# Altium project LimeNet-Micro_2v0.PrjPcb (part 1 of 9)
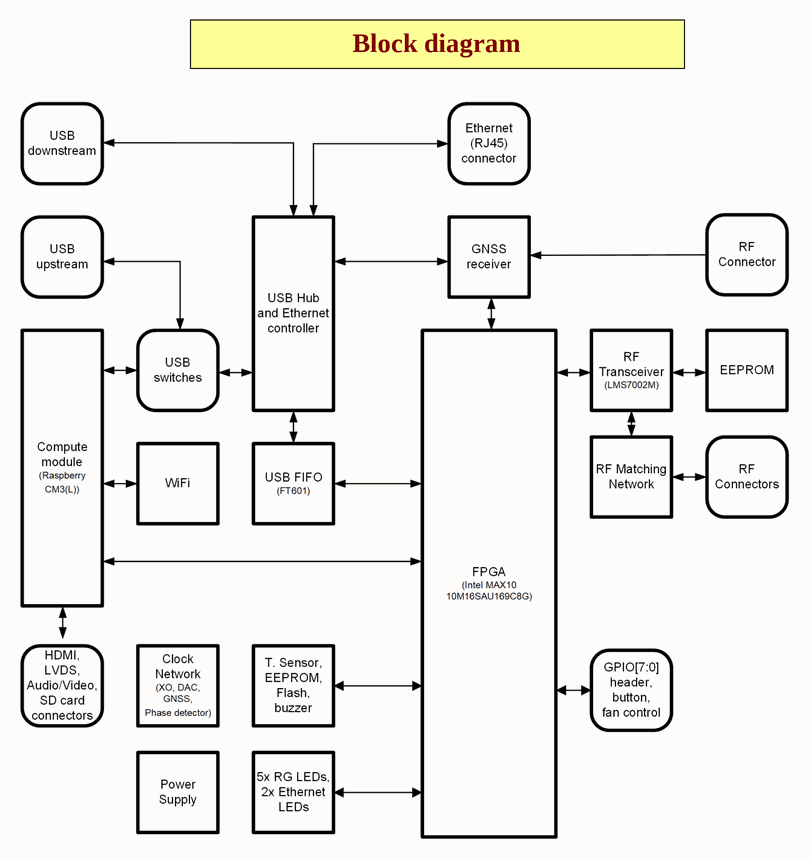
[diagram p0: 01_BlockDiagram.SchDoc]
15 sheets, 786 parts. Net scope: global (net labels, ports and power ports of the same name join across sheets).
Board file: LimeNet-Micro_2v0.PcbDoc
Sheets:
  01_BlockDiagram.SchDoc
  02_PowerDiagram.SchDoc
  03_ClockDiagram.SchDoc
  04_RFDiagram.SchDoc
  05_LMS7002M_Misc.SchDoc
  06_LMS7002M_RF.SchDoc
  07_LMS7002M_Power.SchDoc
  08_FPGA.SchDoc
  09_Misc.SchDoc
  10_USB_Ethernet.SchDoc
  11_USB_FIFO.SchDoc
  12_Raspbbery CM3.SchDoc
  13_Raspberry_Misc.SchDoc
  14_Clocks.SchDoc
  15_PowerSupply.SchDoc

## Sheet 01_BlockDiagram.SchDoc: Block diagram
size A4; Organization: Lime Microsystems; Address1: Surrey Tech Centre; Address2: Guildford GU2 7YG; Address3: Surrey; Address4: United Kingdom; Revision: v2.0; SheetNumber: 1; SheetTotal: 15

### Notes on the sheet
- Block diagram
- Project name:
- Title:
- Size:
- Date:
- A4
- Revision:
- Time:
- Sheet
- of
- File:

## Sheet 02_PowerDiagram.SchDoc: Power diagram
size A4; Organization: Lime Microsystems; Address1: Surrey Tech Centre; Address2: Guildford GU2 7YG; Address3: Surrey; Address4: United Kingdom; Revision: v2.0; SheetNumber: 2; SheetTotal: 15
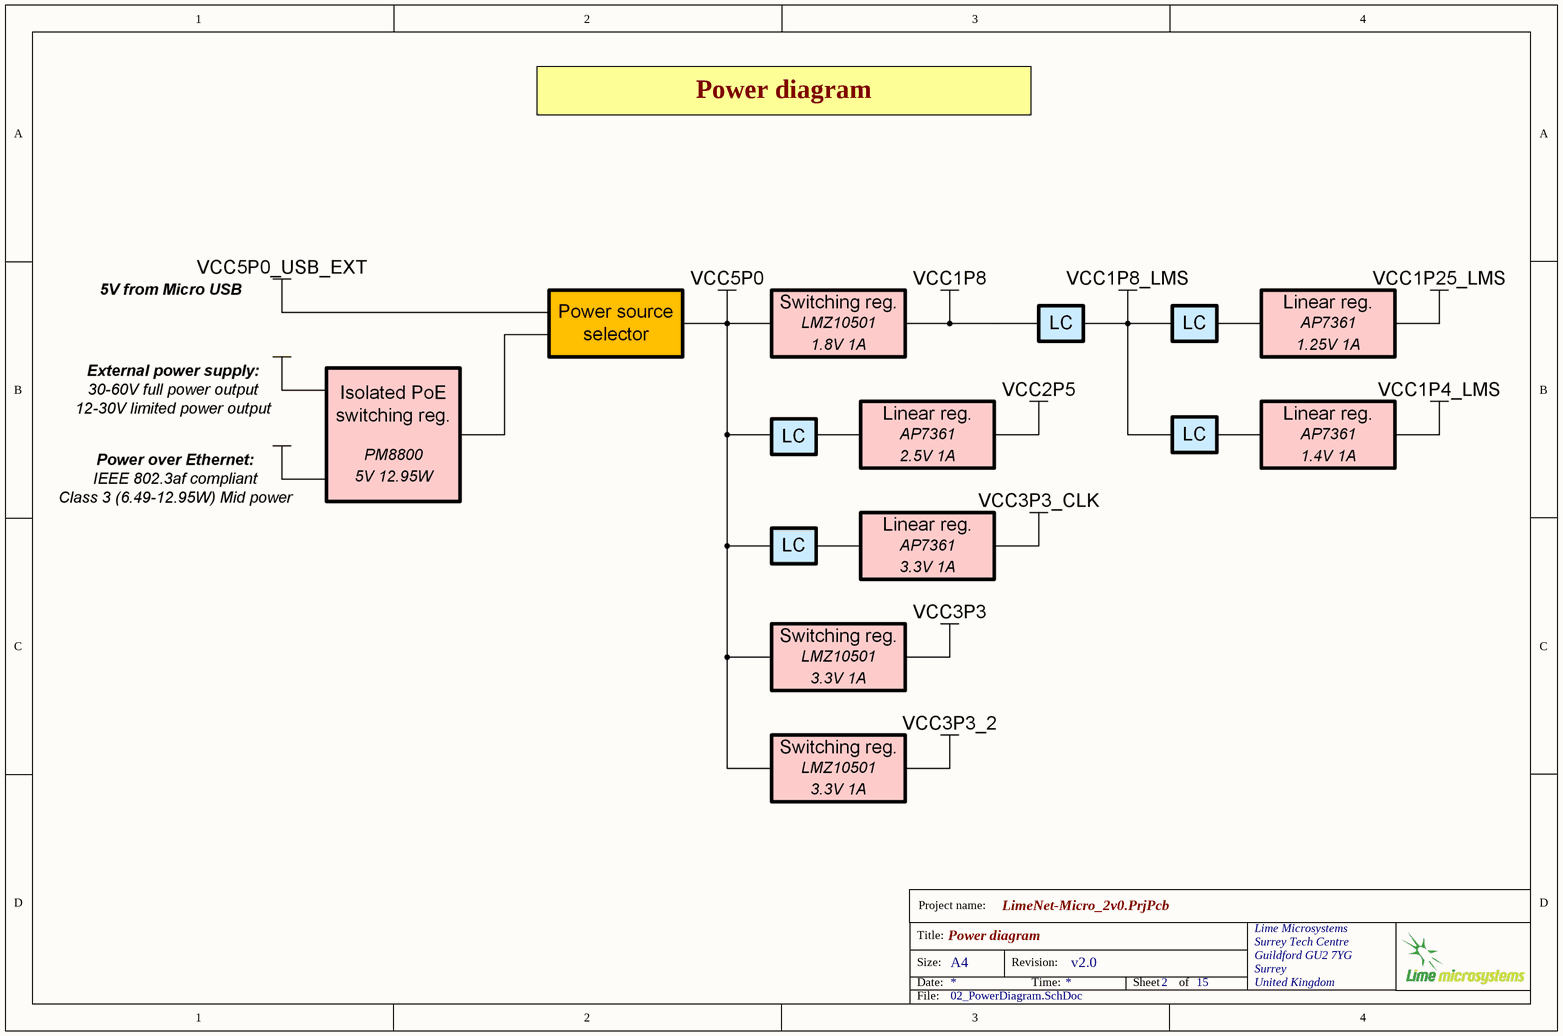
[diagram p1: 02_PowerDiagram.SchDoc]

### Notes on the sheet
- Power diagram
- Project name:
- Title:
- Size:
- Date:
- A4
- Revision:
- Time:
- Sheet
- of
- File:

## Sheet 03_ClockDiagram.SchDoc: Clock diagram
size A4; Organization: Lime Microsystems; Address1: Surrey Tech Centre; Address2: Guildford GU2 7YG; Address3: Surrey; Address4: United Kingdom; Revision: v2.0; SheetNumber: 3; SheetTotal: 15
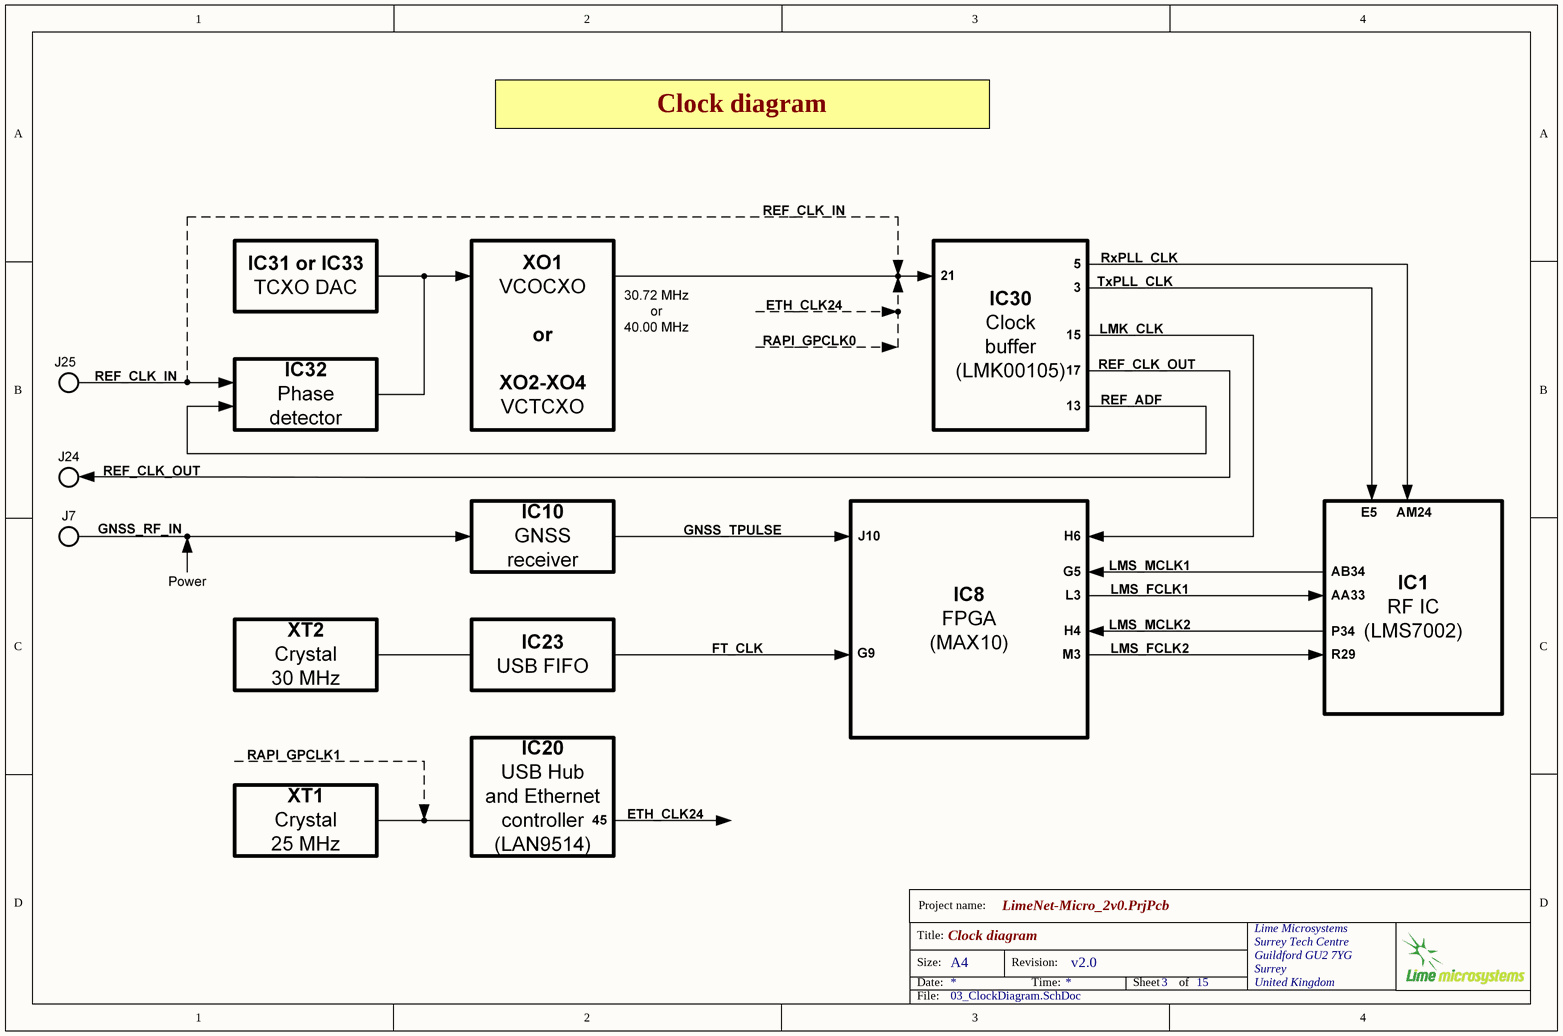
[diagram p2: 03_ClockDiagram.SchDoc]

### Notes on the sheet
- Clock diagram
- Project name:
- Title:
- Size:
- Date:
- A4
- Revision:
- Time:
- Sheet
- of
- File:

## Sheet 04_RFDiagram.SchDoc: RF diagram
size A4; Organization: Lime Microsystems; Address1: Surrey Tech Centre; Address2: Guildford GU2 7YG; Address3: Surrey; Address4: United Kingdom; Revision: v2.0; SheetNumber: 4; SheetTotal: 15
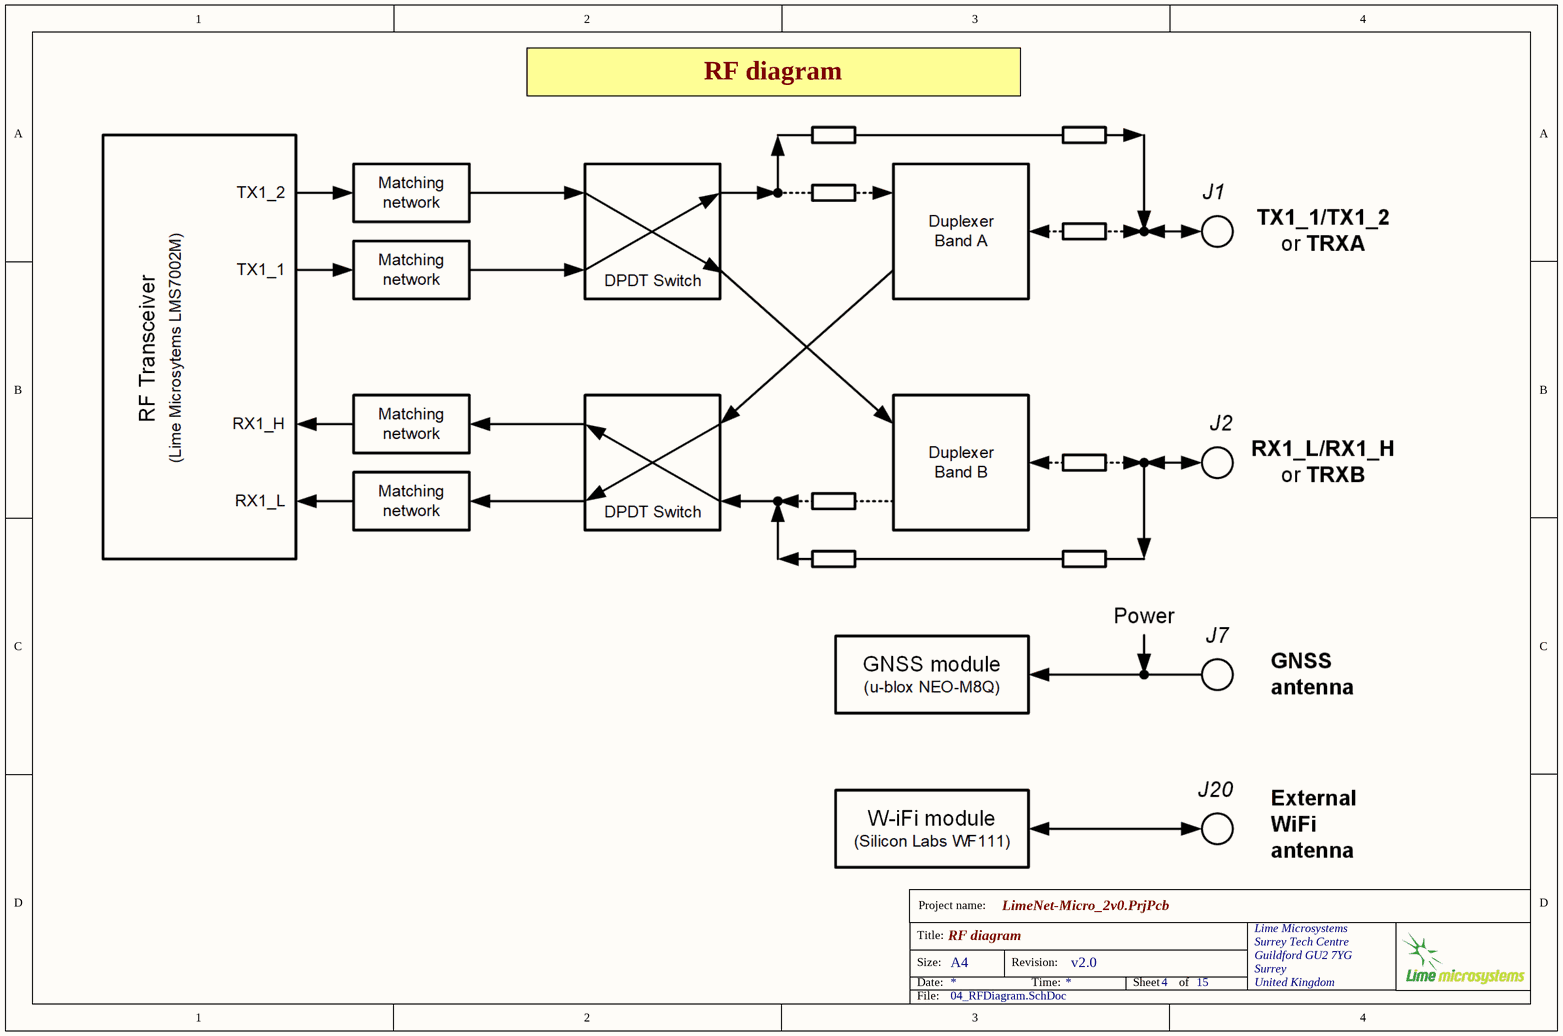
[diagram p3: 04_RFDiagram.SchDoc]

### Notes on the sheet
- RF diagram
- Project name:
- Title:
- Size:
- Date:
- A4
- Revision:
- Time:
- Sheet
- of
- File:

## Sheet 05_LMS7002M_Misc.SchDoc: LMS7002M misc
size A3; Organization: Lime Microsystems; Address1: Surrey Tech Centre; Address2: Guildford GU2 7YG; Address3: Surrey; Address4: United Kingdom; Revision: v2.0; SheetNumber: 5; SheetTotal: 15
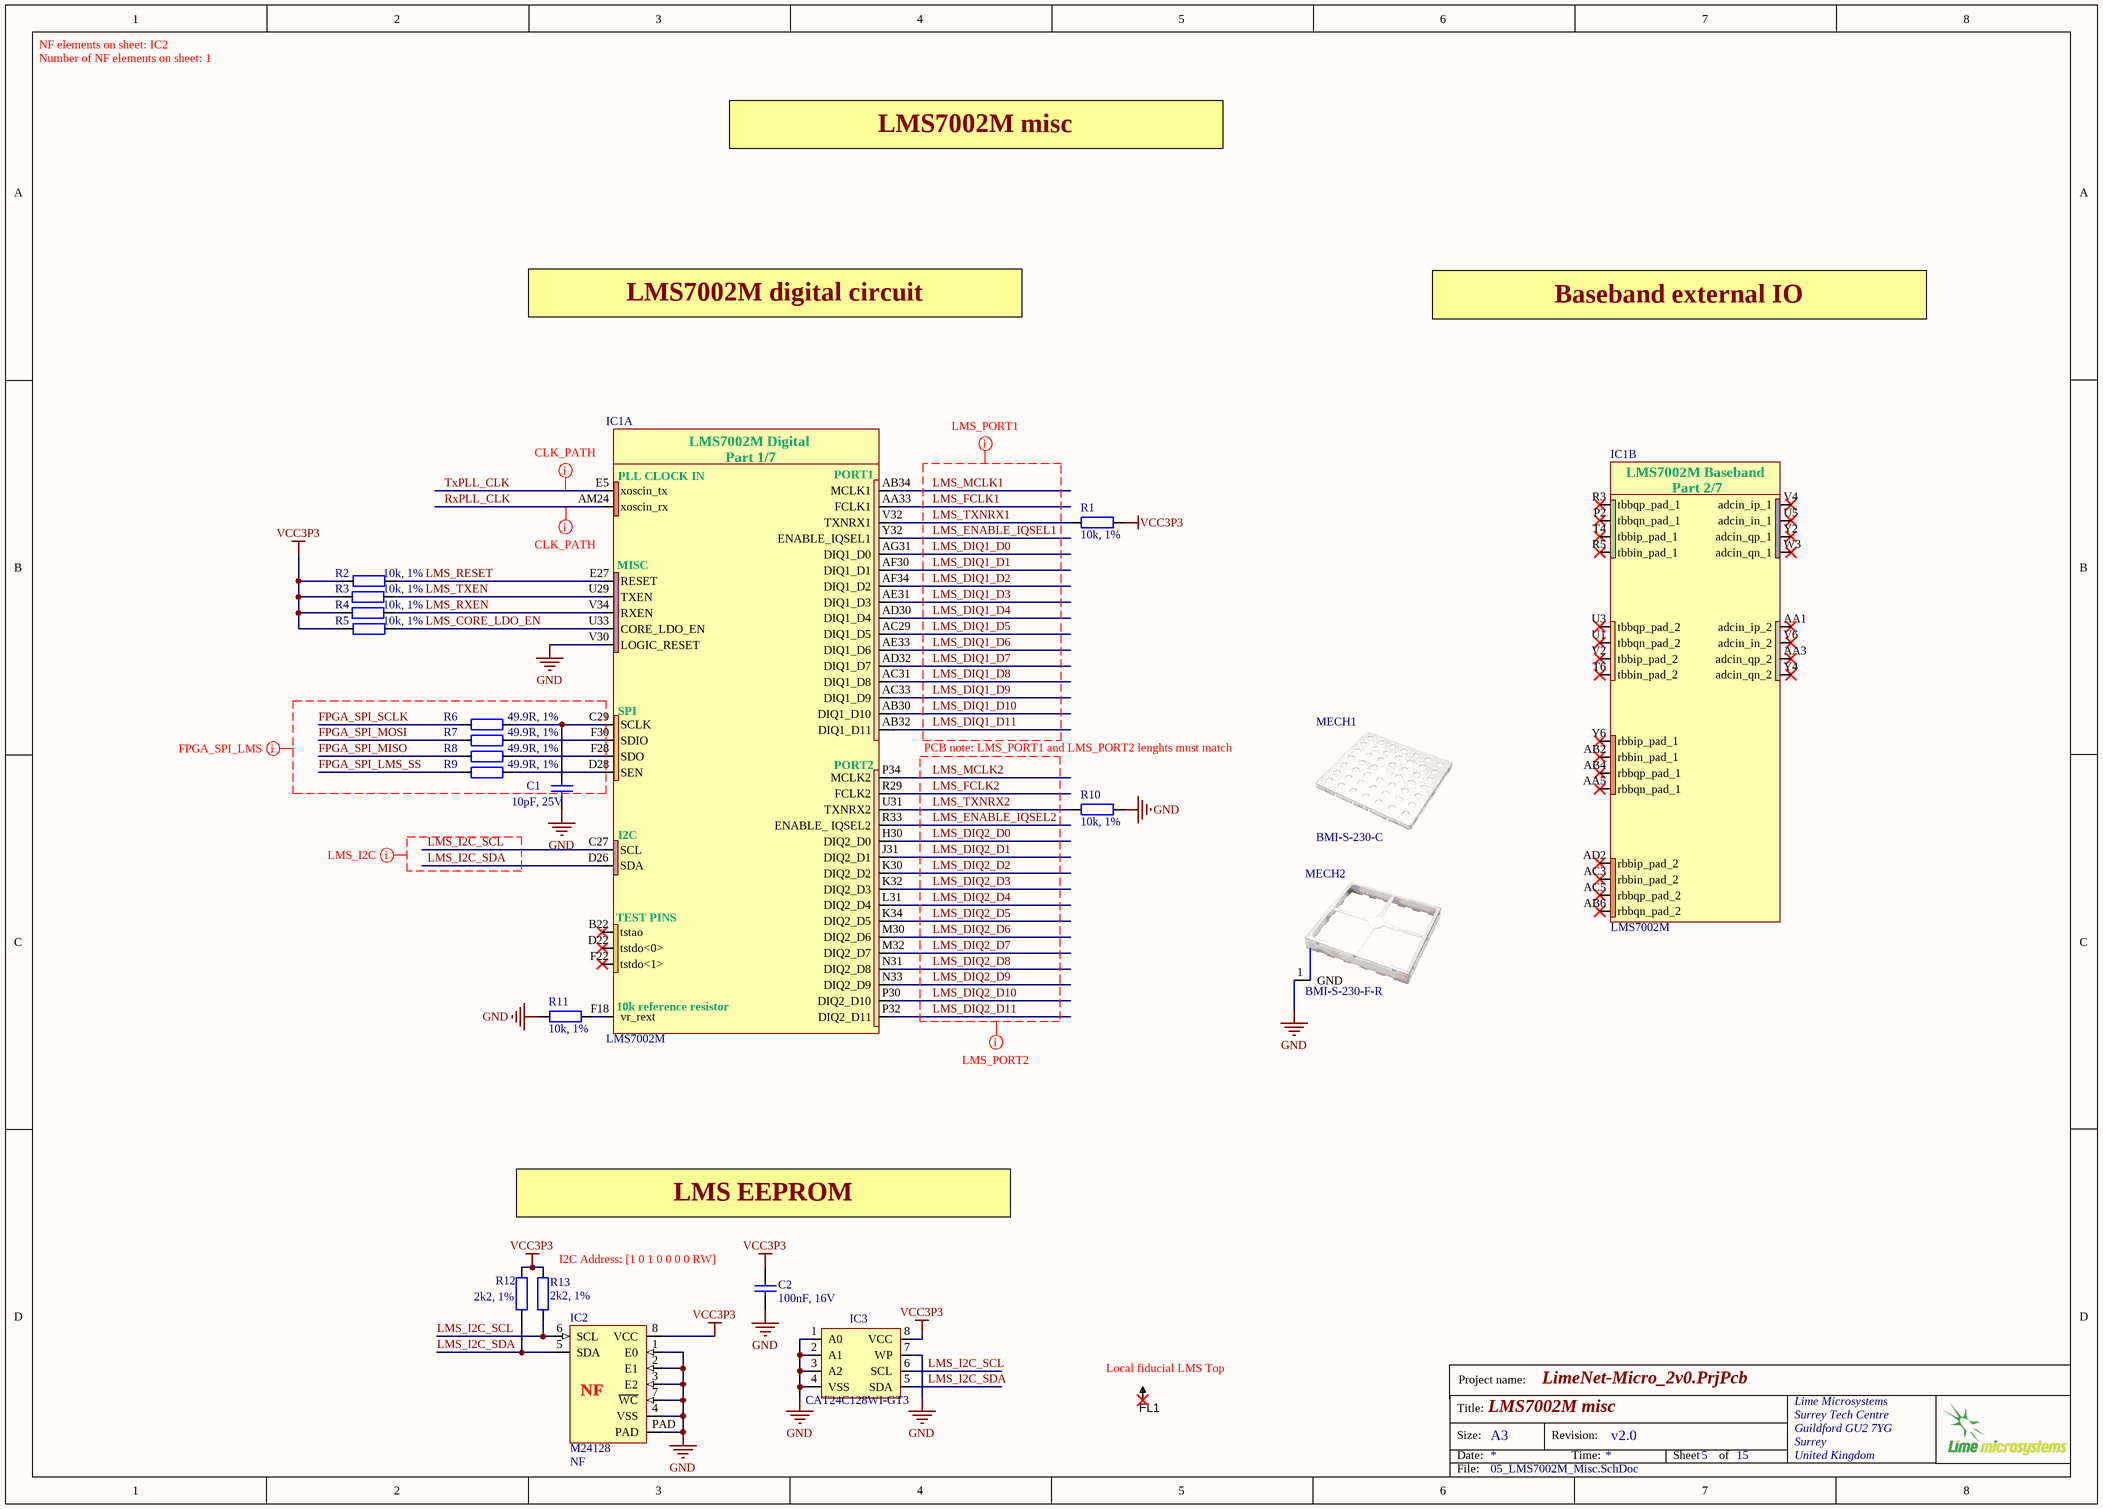
[diagram p4: 05_LMS7002M_Misc.SchDoc]

### Parts
C1  10pF, 25V  [CAP0402]
C2  100nF, 16V  [CAP0402]
FL1  Fiducial  [Fiducial_local]  (value not drawn)
IC1  LMS7002M  [LMS7002M_v5]  (parts A,B of 7)
IC2  M24128  Assembly Info: NF  [M24128-DFMC6TG]
IC3  CAT24C128WI-GT3  [SOIC127P600-8DL_v2]
MECH1  BMI-S-230-C  (mechanical)
MECH2  BMI-S-230-F-R  [RFI_SHIELD_BMI-S-230-F-R]
R1  10k, 1%  [RES0402]
R2  10k, 1%  [RES0402]
R3  10k, 1%  [RES0402]
R4  10k, 1%  [RES0402]
R5  10k, 1%  [RES0402]
R6  49.9R, 1%  [RES0402]
R7  49.9R, 1%  [RES0402]
R8  49.9R, 1%  [RES0402]
R9  49.9R, 1%  [RES0402]
R10  10k, 1%  [RES0402]
R11  10k, 1%  [RES0402]
R12  2k2, 1%  [RES0402]
R13  2k2, 1%  [RES0402]

### Nets
GND: C1.2 C2.2 IC1.V30(LOGIC_RESET) IC2.1(E0) IC2.2(E1) IC2.3(E2) IC2.4(VSS) IC2.7(~{WC}) IC2.PAD IC3.1(A0) IC3.2(A1) IC3.3(A2) IC3.4(VSS) IC3.7(WP) MECH2.1(GND) R10.2 R11.2
VCC3P3: C2.1 IC2.8(VCC) IC3.8(VCC) R1.2 R2.2 R3.1 R4.1 R5.2 R12.1 R13.1
FPGA_SPI_LMS_SS: R9.2
FPGA_SPI_MISO: R8.2
FPGA_SPI_MOSI: R7.2
FPGA_SPI_SCLK: R6.2
LMS_CORE_LDO_EN: IC1.U33(CORE_LDO_EN) R5.1
LMS_DIQ1_D0: IC1.AG31(DIQ1_D0)
LMS_DIQ1_D1: IC1.AF30(DIQ1_D1)
LMS_DIQ1_D2: IC1.AF34(DIQ1_D2)
LMS_DIQ1_D3: IC1.AE31(DIQ1_D3)
LMS_DIQ1_D4: IC1.AD30(DIQ1_D4)
LMS_DIQ1_D5: IC1.AC29(DIQ1_D5)
LMS_DIQ1_D6: IC1.AE33(DIQ1_D6)
LMS_DIQ1_D7: IC1.AD32(DIQ1_D7)
LMS_DIQ1_D8: IC1.AC31(DIQ1_D8)
LMS_DIQ1_D9: IC1.AC33(DIQ1_D9)
LMS_DIQ1_D10: IC1.AB30(DIQ1_D10)
LMS_DIQ1_D11: IC1.AB32(DIQ1_D11)
LMS_DIQ2_D0: IC1.H30(DIQ2_D0)
LMS_DIQ2_D1: IC1.J31(DIQ2_D1)
LMS_DIQ2_D2: IC1.K30(DIQ2_D2)
LMS_DIQ2_D3: IC1.K32(DIQ2_D3)
LMS_DIQ2_D4: IC1.L31(DIQ2_D4)
LMS_DIQ2_D5: IC1.K34(DIQ2_D5)
LMS_DIQ2_D6: IC1.M30(DIQ2_D6)
LMS_DIQ2_D7: IC1.M32(DIQ2_D7)
LMS_DIQ2_D8: IC1.N31(DIQ2_D8)
LMS_DIQ2_D9: IC1.N33(DIQ2_D9)
LMS_DIQ2_D10: IC1.P30(DIQ2_D10)
LMS_DIQ2_D11: IC1.P32(DIQ2_D11)
LMS_ENABLE_IQSEL1: IC1.Y32(ENABLE_IQSEL1)
LMS_ENABLE_IQSEL2: IC1.R33(ENABLE__IQSEL2)
LMS_FCLK1: IC1.AA33(FCLK1)
LMS_FCLK2: IC1.R29(FCLK2)
LMS_I2C_SCL: IC1.C27(SCL) IC2.6(SCL) IC3.6(SCL) R13.2
LMS_I2C_SDA: IC1.D26(SDA) IC2.5(SDA) IC3.5(SDA) R12.2
LMS_MCLK1: IC1.AB34(MCLK1)
LMS_MCLK2: IC1.P34(MCLK2)
LMS_RESET: IC1.E27(RESET) R2.1
LMS_RXEN: IC1.V34(RXEN) R4.2
LMS_TXEN: IC1.U29(TXEN) R3.2
LMS_TXNRX1: IC1.V32(TXNRX1) R1.1
LMS_TXNRX2: IC1.U31(TXNRX2) R10.1
RxPLL_CLK: IC1.AM24(xoscin_rx)
TxPLL_CLK: IC1.E5(xoscin_tx)
NetC1_1: C1.1 IC1.C29(SCLK) R6.1
NetIC1_D28: IC1.D28(SEN) R9.1
NetIC1_F18: IC1.F18(vr_rext) R11.1
NetIC1_F28: IC1.F28(SDO) R8.1
NetIC1_F30: IC1.F30(SDIO) R7.1

Not connected (* = marked no-connect by the designer): FL1 1*; IC1 AA1(adcin_ip_2)* AA3(adcin_qp_2)* AA5(rbbqn_pad_1)* AB2(rbbin_pad_1)* AB4(rbbqp_pad_1)* AB6(rbbqn_pad_2)* AC3(rbbin_pad_2)* AC5(rbbqp_pad_2)* AD2(rbbip_pad_2)* B22(tstao)* D22(tstdo<0>)* F22(tstdo<1>)* P2(tbbqn_pad_1)* R3(tbbqp_pad_1)* R5(tbbin_pad_1)* T4(tbbip_pad_1)* T6(tbbin_pad_2)* U1(tbbqn_pad_2)* U3(tbbqp_pad_2)* U5(adcin_in_1)* V2(tbbip_pad_2)* V4(adcin_ip_1)* V6(adcin_in_2)* W3(adcin_qn_1)* Y2(adcin_qp_1)* Y4(adcin_qn_2)* Y6(rbbip_pad_1)*

### Layout directives
net class CLK_PATH: RxPLL_CLK, TxPLL_CLK
net class FPGA_SPI_LMS: FPGA_SPI_LMS_SS, FPGA_SPI_MISO, FPGA_SPI_MOSI, FPGA_SPI_SCLK
net class LMS_I2C: LMS_I2C_SCL, LMS_I2C_SDA
net class LMS_PORT1: LMS_DIQ1_D0, LMS_DIQ1_D1, LMS_DIQ1_D2, LMS_DIQ1_D3, LMS_DIQ1_D4, LMS_DIQ1_D5, LMS_DIQ1_D6, LMS_DIQ1_D7, LMS_DIQ1_D8, LMS_DIQ1_D9, LMS_DIQ1_D10, LMS_DIQ1_D11, LMS_ENABLE_IQSEL1, LMS_FCLK1, LMS_MCLK1, LMS_TXNRX1
net class LMS_PORT2: LMS_DIQ2_D0, LMS_DIQ2_D1, LMS_DIQ2_D2, LMS_DIQ2_D3, LMS_DIQ2_D4, LMS_DIQ2_D5, LMS_DIQ2_D6, LMS_DIQ2_D7, LMS_DIQ2_D8, LMS_DIQ2_D9, LMS_DIQ2_D10, LMS_DIQ2_D11, LMS_ENABLE_IQSEL2, LMS_FCLK2, LMS_MCLK2, LMS_TXNRX2

### Notes on the sheet
- NF elements on sheet: IC2
- Number of NF elements on sheet: 1
- LMS7002M misc
- LMS7002M digital circuit
- Baseband external IO
- PCB note: LMS_PORT1 and LMS_PORT2 lenghts must match
- LMS EEPROM
- I2C Address: [1 0 1 0 0 0 0 RW]
- (near IC2) NF
- (near FL1) Local fiducial LMS Top
- Project name:
- Title:
- Size:
- Date:
- A3
- Revision:
- Time:
- Sheet
- of
- File:
- (in symbol LMS7002Mr3, part A) LMS7002M Digital; Part 1/7; PLL CLOCK IN; PORT1; MISC; SPI; PORT2; I2C; TEST PINS; 10k reference resistor
- (in symbol LMS7002Mr3, part B) LMS7002M Baseband; Part 2/7

### Library data of the parts
C1 = Cap_0402: Manufacturer Part Number 1: 04023A100JAT2A; Manufacturer: AVX; Part Description: 10pF ±5% 25V C0G, NP0 Ceramic Capacitor -55°C ~ 125°C Surface Mount, MLCC 0402 (1005 Metric) 0.039" L x 0.020" W (1.00mm x 0.50mm); Capacitance Tolerance: ± 5%; Voltage Rating: 25; Ceramic Capacitor Case: 0402 [1005 Metric]; Capacitor Case Style: 0402 [1005 Metric]<!--FANDB--><div class="features-and-benefits-container"></div>; Dielectric Characteristic: C0G / NP0; SVHC: No SVHC (16-Jun-2014); Capacitance: 10; Value: 10pF, 25V; Supplier 1: Farnell; Supplier Part Number 1: 2332478RL; Product Range: -; RoHS: YES; Operating Temperature Min: -55; Operating Temperature Max: 125; Capacitance Tolerance ±: ± 5%; MSL: MSL 1 - Unlimited; Packaging: Cut Tape
C2 = Cap_0603: Manufacturer Part Number 1: GRM155R71C104KA88D; Part Description: CAP CER 0.1UF 16V X7R 0402; Brand: Murata Electronics; Tolerance: 10 %; Type: General Purpose MLCC; Capacitance: 0.1 uF; Temperature Coefficient / Code: +/- 15 %; Supplier 1: Mouser; Supplier Part Number 1: 81-GRM155R71C104KA88; Case Code - in: 0402; Manufacturer: Murata Electronics; Category: Multilayer Ceramic Capacitors MLCC - SMD/SMT; Voltage Rating DC: 16 V; Value: 100nF, 16V; Maximum Operating Temperature: + 125 C; Minimum Operating Temperature: - 55 C; Minimum Order Quantity: 1; Operating Temperature Range: - 55 C to + 125 C; Package / Case: 0402 (1005 metric); Packaging: Reel; Product: General Type MLCCs; Product Category: Low & Medium Capacitance SMD Ceramic Chip Capacitors; Reeling: True; RoHS - Mouser: Y; RoHS: RoHS Compliant; Series: GRM; Standard Pack Qty: 10000; Termination Style: SMD/SMT
IC1 = LMS7002Mr3: Schematic symbol revision 3. Default footprint - 0.31mm pad; Manufacturer: Lime Microsystems; Part Description: IC FPRF Transceiver LMS7002M; 261 pin aQFN; Supplier 1: Lime Microsystems; Supplier Part Number 1: LMS7002M; Manufacturer Part Number 1: LMS7002M
IC2 = M24128-DFMC6TG: Manufacturer: STMicroelectronics; Part Description: EEPROM Memory IC 128Kb (16K x 8) I²C 1MHz 450ns 8-UFDFPN (2x3); Memory Type: Non-Volatile; Memory Format: EEPROM; Memory Size: 128Kb (16K x 8); Write Cycle Time - Word, Page: 5ms; Memory Interface: I²C; Voltage - Supply: 1.7 V ~ 5.5 V; Supplier 1: Digi-Key; Manufacturer Part Number 1: M24128-DFMC6TG; RoHS: RoHS Compliant; Category: Integrated Circuits (ICs); Stock 1: 5894; Pricing 1: 1=0.35, 10=0.348, 100=0.2854, 500=0.27748, 1000=0.27004 (USD); Packaging: Cut Tape (CT); Part Status: Active; Technology: EEPROM; Operating Temperature: -40°C ~ 85°C (TA); Mounting Type: Surface Mount; Package / Case: 8-UFDFN Exposed Pad; Supplier Device Package: 8-UFDFPN (2x3); ComponentLink1URL: http://www.st.com/content/ccc/resource/technical/document/datasheet/59/05/c9/5b/7b/41/48/b6/CD00259167.pdf/files/CD00259167.pdf/jcr:content/translations/en.CD00259167.pdf; ComponentLink1Description: http://www.st.com/content/ccc/resource/technical/document/datasheet/59/05/c9/5b/7b/41/48/b6/CD00259167.pdf/files/CD00259167.pdf/jcr:content/translations/en.CD00259167.pdf; Supplier Part Number 1: 497-15739-1-ND
IC3 = 24FC64F: Part Description: EEPROM Memory IC 128Kb (16K x 8) I²C 1MHz 400ns 8-SOIC; Manufacturer: ON Semiconductor; Memory Type: Non-Volatile; Memory Format: EEPROM; Memory Size: 128Kb (16K x 8); Write Cycle Time - Word, Page: 5ms; Memory Interface: I²C; Voltage - Supply: 1.8 V ~ 5.5 V; Supplier 1: Digi-Key; Supplier Part Number 1: CAT24C128WI-GT3CT-ND; Manufacturer Part Number 1: CAT24C128WI-GT3; RoHS: RoHS Compliant; Category: Integrated Circuits (ICs); Stock 1: 14804; Pricing 1: 1=0.31, 10=0.309, 100=0.2532, 500=0.24616, 1000=0.23956 (USD); Packaging: Cut Tape (CT); Part Status: Active; Technology: EEPROM; Operating Temperature: -40°C ~ 85°C (TA); Mounting Type: Surface Mount; Package / Case: 8-SOIC (0.154", 3.90mm Width); Supplier Device Package: 8-SOIC; Base Part Number: CAT24C128; ComponentLink1URL: http://www.onsemi.com/pub/Collateral/CAT24C128-D.PDF; ComponentLink1Description: http://www.onsemi.com/pub/Collateral/CAT24C128-D.PDF
MECH1 = RFI_SHIELD_2_cover: Part Description: RF Shield Cover 2.000" (50.80mm) X 1.500" (38.10mm) Vent Holes in Pattern Snap Fit; Manufacturer: Laird Technologies EMI; Ventilation: Vent Holes in Pattern; Supplier 1: Digi-Key; Supplier Part Number 1: 903-1471-ND; Manufacturer Part Number 1: BMI-S-230-C; RoHS: RoHS Compliant; Category: RF/IF and RFID; Stock 1: 15865; Pricing 1: 1=1.51, 10=1.333, 25=1.2044, 100=1.0537, 250=0.92472, 500=0.8172, 1000=0.64515, 2500=0.60214, 5000=0.57203 (USD); Packaging: Bulk; Part Status: Active; Type: Cover; Height - Overall: 0.200" (5.08mm); Length - Overall: 1.500" (38.10mm); Width - Overall: 2.000" (50.80mm); Mounting Type: Snap Fit; ComponentLink1URL: https://media.digikey.com/pdf/Data%20Sheets/Laird%20Technologies/BMI-S-230-C_Dwg.pdf; ComponentLink1Description: https://media.digikey.com/pdf/Data%20Sheets/Laird%20Technologies/BMI-S-230-C_Dwg.pdf
MECH2 = RFI_SHIELD_2_frame: Part Description: RF Shield Frame 2.000" (50.80mm) X 1.500" (38.10mm) Solder; Manufacturer: Laird Technologies EMI; Supplier 1: Digi-Key; Supplier Part Number 1: 903-1470-1-ND; Manufacturer Part Number 1: BMI-S-230-F-R; RoHS: RoHS Compliant; Category: RF/IF and RFID; Stock 1: 12638; Pricing 1: 1=1.95, 10=1.726, 25=1.5588 (USD); Packaging: Cut Tape (CT); Part Status: Active; Type: Frame; Height - Overall: 0.200" (5.08mm); Length - Overall: 1.500" (38.10mm); Width - Overall: 2.000" (50.80mm); Ventilation: -; Mounting Type: Solder; ComponentLink1URL: https://media.digikey.com/pdf/Data%20Sheets/Laird%20Technologies/BMI-S-230-F_Dwg.pdf; ComponentLink1Description: https://media.digikey.com/pdf/Data%20Sheets/Laird%20Technologies/BMI-S-230-F_Dwg.pdf
R1-R5 R10 R11 = Res_0402: Manufacturer: Yageo; Manufacturer Part Number 1: RC0402FR-0710KL; Part Description: RES SMD 10K OHM 1% 1/16W 0402; Temperature Coefficient: ±100ppm/°C; Power (Watts): 0.063W, 1/16W; Value: 10k, 1%; Supplier 1: Digi-Key; Supplier Part Number 1: 311-10.0KLRTR-ND; Resistance (Ohms): 10k; Packaging: Tape & Reel (TR); RoHS: RoHS Compliant; Package / Case: 0402 (1005 Metric); Tolerance: ±1%; Operating Temperature: -55°C ~ 155°C; Size / Dimension: 0.039" L x 0.020" W (1.00mm x 0.50mm); Number of Terminations: 2; Category: Resistors; Height: 0.016" (0.40mm); Supplier Device Package: 0402; Features: Moisture Resistant; Composition: Thick Film
R6-R9 = Res_0402: Manufacturer: Samsung Electro-Mechanics America, Inc.; Manufacturer Part Number: RC1005F49R9CS; Part Description: RES SMD 49.9 OHM 1% 1/16W 0402; Temperature Coefficient: ±100ppm/°C; Resistance (Ohms): 49.9; Power (Watts): 0.063W, 1/16W; Number of Terminations: 2; Size / Dimension: 0.039" L x 0.020" W (1.00mm x 0.50mm); Supplier Device Package: 0402 (1005 Metric); RoHS: RoHS Compliant; Supplier Part Number 1: 1276-3469-6-ND; Features: -; Packaging: Digi-Reel®; Tolerance: ±1%; Height: 0.016" (0.40mm); Category: Resistors; Composition: Thick Film; Package / Case: 0402 (1005 Metric); Supplier 1: Digi-Key; Operating Temperature: -55°C ~ 155°C; Value: 49.9R, 1%
R12 R13 = Res_0402: Manufacturer: Stackpole Electronics Inc; Manufacturer Part Number 1: RMCF0402FT2K20; Part Description: RES SMD 2.2K OHM 1% 1/16W 0402; Resistance (Ohms): 2.2k; Temperature Coefficient: ±100ppm/°C; Power (Watts): 0.063W, 1/16W; Value: 2k2, 1%; Supplier 1: Digi-Key; Supplier Part Number 1: RMCF0402FT2K20CT-ND; Supplier Device Package: 0402; Package / Case: 0402 (1005 Metric); Size / Dimension: 0.039" L x 0.020" W (1.00mm x 0.50mm); Operating Temperature: -55°C ~ 155°C; Composition: Thick Film; Category: Resistors; Features: -; Height: 0.016" (0.40mm); RoHS: RoHS Compliant; Number of Terminations: 2; Packaging: Cut Tape (CT); Tolerance: ±1%

## Sheet 06_LMS7002M_RF.SchDoc: LMS7002M RF
size A3; Organization: Lime Microsystems; Address1: Surrey Tech Centre; Address2: Guildford GU2 7YG; Address3: Surrey; Address4: United Kingdom; Revision: v2.0; SheetNumber: 6; SheetTotal: 15
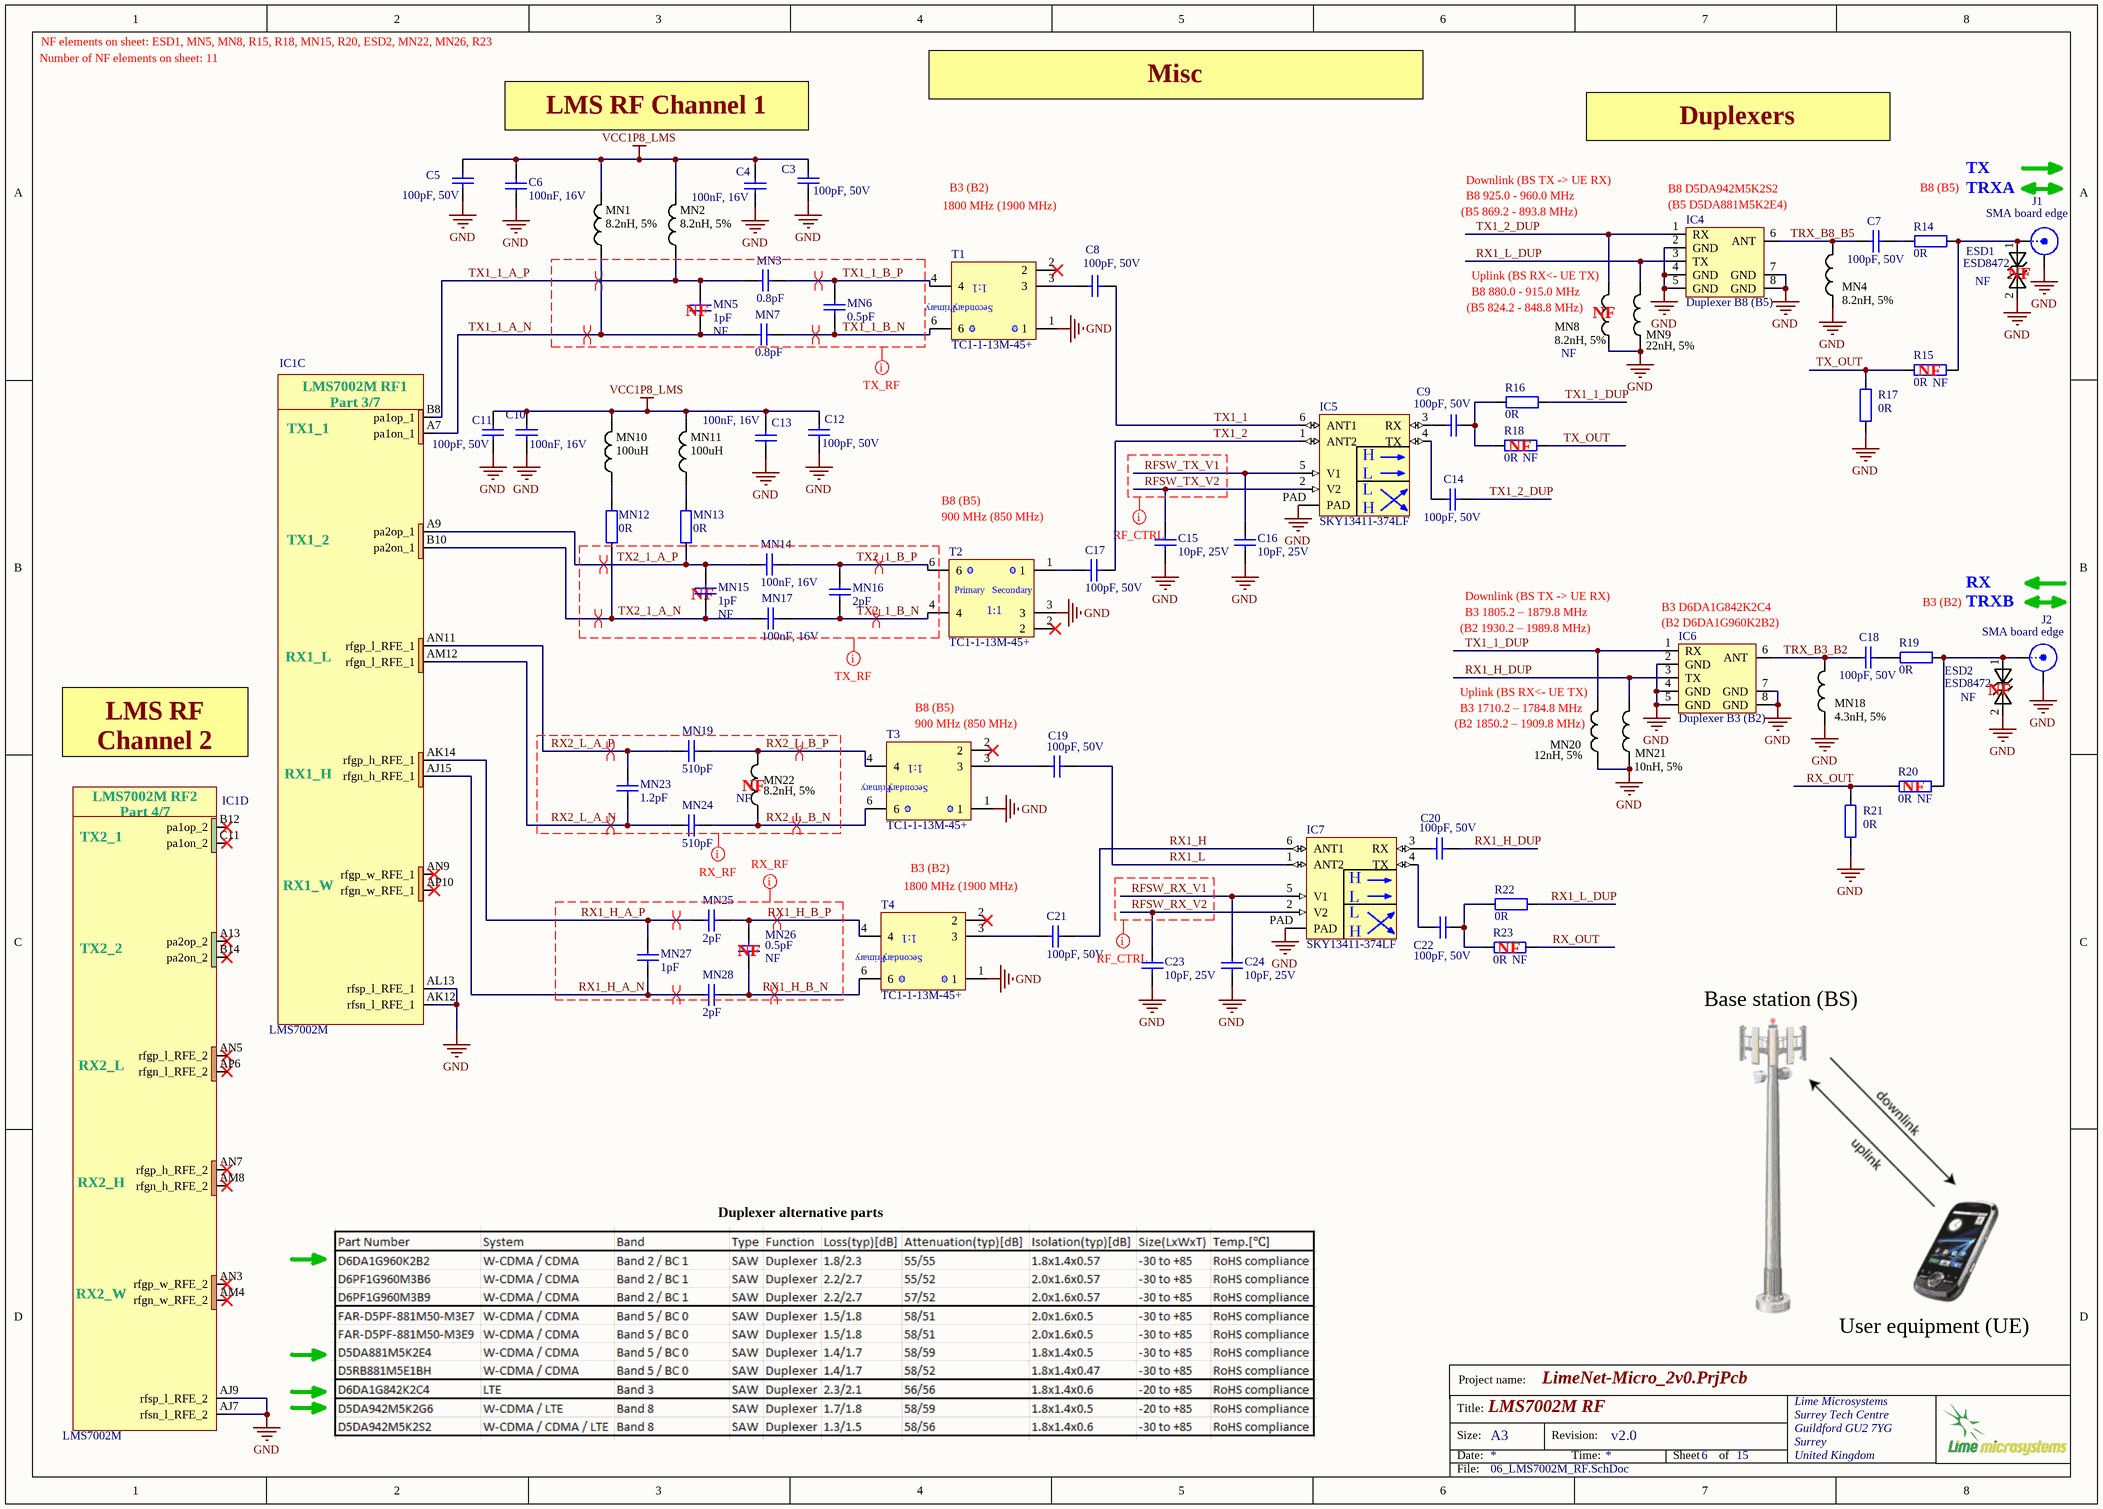
[diagram p5: 06_LMS7002M_RF.SchDoc]

### Parts
C3  100pF, 50V  [CAP0402]
C4  100nF, 16V  [CAP0402]
C5  100pF, 50V  [CAP0402]
C6  100nF, 16V  [CAP0402]
C7  100pF, 50V  [CAP0402]
C8  100pF, 50V  [CAP0402]
C9  100pF, 50V  [CAP0402]
C10  100nF, 16V  [CAP0402]
C11  100pF, 50V  [CAP0402]
C12  100pF, 50V  [CAP0402]
C13  100nF, 16V  [CAP0402]
C14  100pF, 50V  [CAP0402]
C15  10pF, 25V  [CAP0402]
C16  10pF, 25V  [CAP0402]
C17  100pF, 50V  [CAP0402]
C18  100pF, 50V  [CAP0402]
C19  100pF, 50V  [CAP0402]
C20  100pF, 50V  [CAP0402]
C21  100pF, 50V  [CAP0402]
C22  100pF, 50V  [CAP0402]
C23  10pF, 25V  [CAP0402]
C24  10pF, 25V  [CAP0402]
ESD1  ESD8472  Assembly Info: NF  [ESD8472_X3DFN2]
ESD2  ESD8472  Assembly Info: NF  [ESD8472_X3DFN2]
IC1  LMS7002M  [LMS7002M_v5]  (parts C,D of 7)
IC4  Duplexer B8 (B5)  [SAW_filter_duplexer_TAIYO_YUDEN_1p8x1p4_2p0x1p6]
IC5  SKY13411-374LF  [SKY13411-374LF]
IC6  Duplexer B3 (B2)  [SAW_filter_duplexer_TAIYO_YUDEN_1p8x1p4_2p0x1p6]
IC7  SKY13411-374LF  [SKY13411-374LF]
J1  SMA board edge  [SMA_connector_board_edge_SM]
J2  SMA board edge  [SMA_connector_board_edge_SM]
MN1  8.2nH, 5%  [RES0402]
MN2  8.2nH, 5%  [RES0402]
MN3  0.8pF  [CAP0402]
MN4  8.2nH, 5%  [RES0402]
MN5  1pF  Assembly Info: NF  [CAP0402]
MN6  0.5pF  [CAP0402]
MN7  0.8pF  [CAP0402]
MN8  8.2nH, 5%  Assembly Info: NF  [RES0402]
MN9  22nH, 5%  [RES0402]
MN10  100uH  [RES0805]
MN11  100uH  [RES0805]
MN12  0R  [RES0402]
MN13  0R  [RES0402]
MN14  100nF, 16V  [CAP0402]
MN15  1pF  Assembly Info: NF  [CAP0402]
MN16  2pF  [CAP0402]
MN17  100nF, 16V  [CAP0402]
MN18  4.3nH, 5%  [RES0402]
MN19  510pF  [CAP0402]
MN20  12nH, 5%  [RES0402]
MN21  10nH, 5%  [RES0402]
MN22  8.2nH, 5%  Assembly Info: NF  [RES0402]
MN23  1.2pF  [CAP0402]
MN24  510pF  [CAP0402]
MN25  2pF  [CAP0402]
MN26  0.5pF  Assembly Info: NF  [CAP0402]
MN27  1pF  [CAP0402]
MN28  2pF  [CAP0402]
R14  0R  [RES0402_v3]
R15  0R  Assembly Info: NF  [RES0402_v3]
R16  0R  [RES0402_v3]
R17  0R  [RES0402]
R18  0R  Assembly Info: NF  [RES0402_v3]
R19  0R  [RES0402_v3]
R20  0R  Assembly Info: NF  [RES0402_v3]
R21  0R  [RES0402]
R22  0R  [RES0402_v3]
R23  0R  Assembly Info: NF  [RES0402_v3]
T1  TC1-1-13M-45+  [TC1-1-13MA+_JA4220-AL_]
T2  TC1-1-13M-45+  [TC1-1-13MA+_JA4220-AL_]
T3  TC1-1-13M-45+  [TC1-1-13MA+_JA4220-AL_]
T4  TC1-1-13M-45+  [TC1-1-13MA+_JA4220-AL_]

### Nets
GND: C3.2 C4.1 C5.2 C6.1 C10.1 C11.2 C12.2 C13.1 C15.1 C16.1 C23.1 C24.1 ESD1.2 ESD2.2 IC1.AJ7(rfsn_l_RFE_2) IC1.AJ9(rfsp_l_RFE_2) IC1.AK12(rfsn_l_RFE_1) IC1.AL13(rfsp_l_RFE_1) IC4.2(GND) IC4.4(GND) IC4.5(GND) IC4.7(GND) IC4.8(GND) IC5.PAD IC6.2(GND) IC6.4(GND) IC6.5(GND) IC6.7(GND) IC6.8(GND) IC7.PAD J1.2(Y) J2.2(Y) MN4.1 MN8.1 MN9.1 MN18.1 MN20.1 MN21.1 R17.2 R21.2 T1.1 T2.3 T3.1 T4.1
VCC1P8_LMS: C3.1 C4.2 C5.1 C6.2 C10.2 C11.1 C12.1 C13.2 MN1.2 MN2.2 MN10.2 MN11.2
RFSW_RX_V1: C24.2 IC7.5(V1)
RFSW_RX_V2: C23.2 IC7.2(V2)
RFSW_TX_V1: C16.2 IC5.5(V1)
RFSW_TX_V2: C15.2 IC5.2(V2)
RX1_H: C21.1 IC7.6(ANT1)
RX1_H_A_N: IC1.AJ15(rfgn_h_RFE_1) MN27.1 MN28.2
RX1_H_A_P: IC1.AK14(rfgp_h_RFE_1) MN25.2 MN27.2
RX1_H_B_N: MN26.1 MN28.1 T4.6
RX1_H_B_P: MN25.1 MN26.2 T4.4
RX1_H_DUP: C20.1 IC6.3(TX) MN21.2
RX1_L: C19.1 IC7.1(ANT2)
RX1_L_DUP: IC4.3(TX) MN9.2 R22.2
RX2_L_A_N: IC1.AM12(rfgn_l_RFE_1) MN23.1 MN24.2
RX2_L_A_P: IC1.AN11(rfgp_l_RFE_1) MN19.2 MN23.2
RX2_L_B_N: MN22.1 MN24.1 T3.6
RX2_L_B_P: MN19.1 MN22.2 T3.4
RX_OUT: R20.1 R21.1 R23.2
TRX_B3_B2: C18.2 IC6.6(ANT) MN18.2
TRX_B8_B5: C7.2 IC4.6(ANT) MN4.2
TX1_1: C8.1 IC5.6(ANT1)
TX1_1_A_N: IC1.A7(pa1on_1) MN1.1 MN5.1 MN7.2
TX1_1_A_P: IC1.B8(pa1op_1) MN2.1 MN3.1 MN5.2
TX1_1_B_N: MN6.2 MN7.1 T1.6
TX1_1_B_P: MN3.2 MN6.1 T1.4
TX1_1_DUP: IC6.1(RX) MN20.2 R16.2
TX1_2: C17.1 IC5.1(ANT2)
TX1_2_DUP: C14.1 IC4.1(RX) MN8.2
TX2_1_A_N: IC1.B10(pa2on_1) MN12.1 MN15.2 MN17.1
TX2_1_A_P: IC1.A9(pa2op_1) MN13.1 MN14.2 MN15.1
TX2_1_B_N: MN16.1 MN17.2 T2.4
TX2_1_B_P: MN14.1 MN16.2 T2.6
TX_OUT: R15.1 R17.1 R18.2
NetC7_1: C7.1 R14.1
NetC8_2: C8.2 T1.3
NetC9_1: C9.1 R16.1 R18.1
NetC9_2: C9.2 IC5.3(RX)
NetC14_2: C14.2 IC5.4(TX)
NetC17_2: C17.2 T2.1
NetC18_1: C18.1 R19.1
NetC19_2: C19.2 T3.3
NetC20_2: C20.2 IC7.3(RX)
NetC21_2: C21.2 T4.3
NetC22_1: C22.1 R22.1 R23.1
NetC22_2: C22.2 IC7.4(TX)
NetESD1_1: ESD1.1 J1.1(X) R14.2 R15.2
NetESD2_1: ESD2.1 J2.1(X) R19.2 R20.2
NetMN10_1: MN10.1 MN12.2
NetMN11_1: MN11.1 MN13.2

Not connected (* = marked no-connect by the designer): IC1 A13(pa2op_2)* AM4(rfgn_w_RFE_2)* AM8(rfgn_h_RFE_2)* AN3(rfgp_w_RFE_2)* AN5(rfgp_l_RFE_2)* AN7(rfgp_h_RFE_2)* AN9(rfgp_w_RFE_1)* AP6(rfgn_l_RFE_2)* AP10(rfgn_w_RFE_1)* B12(pa1op_2)* B14(pa2on_2)* C11(pa1on_2)*; T1 2*; T2 2*; T3 2*; T4 2*

### Layout directives
differential pair: RX1_H_A_N, RX1_H_A_P, RX1_H_B_N, RX1_H_B_P, RX2_L_A_N, RX2_L_A_P, RX2_L_B_N, RX2_L_B_P, TX1_1_A_N, TX1_1_A_P, TX1_1_B_N, TX1_1_B_P, TX2_1_A_N, TX2_1_A_P, TX2_1_B_N, TX2_1_B_P
net class RX_RF: RX1_H_A_N, RX1_H_A_P, RX1_H_B_N, RX1_H_B_P, RX2_L_A_N, RX2_L_A_P, RX2_L_B_N, RX2_L_B_P
net class TX_RF: TX1_1_B_N, TX1_1_B_P, TX2_1_A_N, TX2_1_A_P, TX2_1_B_N, TX2_1_B_P
net class RF_CTRL: RFSW_RX_V1, RFSW_RX_V2, RFSW_TX_V1, RFSW_TX_V2

### Notes on the sheet
- NF elements on sheet: ESD1, MN5, MN8, R15, R18, MN15, R20, ESD2, MN22, MN26, R23
- Number of NF elements on sheet: 11
- Misc
- LMS RF Channel 1
- Duplexers
- TX
- 1800 MHz (1900 MHz)
- B3 (B2)
- (B5 869.2 - 893.8 MHz)
- Downlink (BS TX -> UE RX)
- B8 925.0 - 960.0 MHz
- (near IC4) B8 D5DA942M5K2S2
- (near IC4) (B5 D5DA881M5K2E4)
- B8 (B5)
- TRXA
- (near MN5) NF
- (near MN8) (B5 824.2 - 848.8 MHz)
- (near MN8) B8 880.0 - 915.0 MHz
- (near MN8) Uplink (BS RX<- UE TX)
- (near MN8) NF
- (near ESD1) NF
- (near R15) NF
- (near R18) NF
- 900 MHz (850 MHz)
- (near IC5) H
- (near IC5) L
- RX
- (near MN15) NF
- (B2 1930.2 – 1989.8 MHz)
- B3 1805.2 – 1879.8 MHz
- (near IC6) B3 D6DA1G842K2C4
- (near IC6) (B2 D6DA1G960K2B2)
- TRXB
- (near T3) B8 (B5)
- (near MN20) B3 1710.2 – 1784.8 MHz
- (near MN20) Uplink (BS RX<- UE TX)
- (near ESD2) NF
- LMS RF Channel 2
- (near T3) 900 MHz (850 MHz)
- (near MN20) (B2 1850.2 – 1909.8 MHz)
- (near MN22) NF
- (near R20) NF
- (near T4) 1800 MHz (1900 MHz)
- (near IC7) H
- (near IC7) L
- (near MN26) NF
- (near R23) NF
- Base station (BS)
- Duplexer alternative parts
- User equipment (UE)
- Project name:
- Title:
- Size:
- Date:
- A3
- Revision:
- Time:
- Sheet
- of
- File:
- (in symbol LMS7002Mr3, part C) LMS7002M RF1; Part 3/7; TX1_1; TX1_2; RX1_L; RX1_H; RX1_W
- (in symbol TC1-1-13M+) Primary; Secondary; 1:1

### Library data of the parts
C3 C5 C7-C9 C11 C12 C14 C17-C22 = Cap_0402: Manufacturer Part Number 1: CC0402JRNPO9BN101; Manufacturer: Yageo; Part Description: 100pF ±5% 50V C0G, NP0 Ceramic Capacitor -55°C ~ 125°C Surface Mount, MLCC 0402 (1005 Metric) 0.039" L x 0.020" W (1.00mm x 0.50mm); Tolerance: ±5%; Temperature Coefficient: C0G, NP0; Value: 100pF, 50V; Capacitance: 100pF; Thickness (Max): 0.022" (0.55mm); Size / Dimension: 0.039" L x 0.020" W (1.00mm x 0.50mm); RoHS: RoHS Compliant; Ratings: -; Package / Case: 0402 (1005 Metric); Mounting Type: Surface Mount, MLCC; Height - Seated (Max): -; Features: -; Lead Spacing: -; Voltage - Rated: 50V; Operating Temperature: -55°C ~ 125°C; Packaging: Cut Tape (CT); Applications: General Purpose; Lead Style: -; Supplier 1: Digi-Key; Category: Capacitors; Supplier Part Number 1: 311-1024-1-ND
C4 C6 C10 C13 = Cap_0402: Manufacturer: Murata Electronics; Manufacturer Part Number: GRM155R71C104KA88D; Part Description: CAP CER 0.1UF 16V X7R 0402; Tolerance: 10 %; Type: General Purpose MLCC; Capacitance: 0.1 uF; Case Length: 1 mm; Dielectric: X7R; Case Height: 0.5 mm; Temperature Coefficient / Code: +/- 15 %; Value: 100nF, 16V; Supplier 1: Mouser; Supplier Part Number 1: 81-GRM155R71C104KA88; Case Code - in: 0402; RoHS: RoHS Compliant; Operating Temperature Range: - 55 C to + 125 C; Series: GRM; Termination Style: SMD/SMT; Package / Case: 0402 (1005 metric); Voltage Rating DC: 16 V; Maximum Operating Temperature: + 125 C; Case Code - mm: 1005; Minimum Operating Temperature: - 55 C; Product Category: Low & Medium Capacitance SMD Ceramic Chip Capacitors; Packaging: Reel; Product: General Type MLCCs; Category: Multilayer Ceramic Capacitors MLCC - SMD/SMT; Brand: Murata Electronics; Case Width: 0.5 mm; RoHS - Mouser: Y; Standard Pack Qty: 10000; Minimum Order Quantity: 1; Reeling: True; Manufacturer Part Number 1: GRM155R71C104KA88D
C15 C16 C23 C24 = Cap_0402: Manufacturer: AVX; Manufacturer Part Number 1: 04023A100JAT2A; Part Description: 10pF ±5% 25V C0G, NP0 Ceramic Capacitor -55°C ~ 125°C Surface Mount, MLCC 0402 (1005 Metric) 0.039" L x 0.020" W (1.00mm x 0.50mm); Capacitance: 10; Ceramic Capacitor Case: 0402 [1005 Metric]; Capacitance Tolerance: ± 5%; Capacitor Case Style: 0402 [1005 Metric]<!--FANDB--><div class="features-and-benefits-container"></div>; Voltage Rating: 25; Supplier 1: Farnell; Supplier Part Number 1: 2332478RL; value: 10pF, 25V; Capacitance Tolerance ±: ± 5%; MSL: MSL 1 - Unlimited; Operating Temperature Max: 125; Operating Temperature Min: -55; Packaging: Cut Tape
ESD1 ESD2 = ESD8472: Manufacturer: ON Semiconductor; Manufacturer Part Number: ESD8472MUT5G; Part Description: TVS DIODE 5.3VWM 14VC X3DFN2; Voltage - Reverse Standoff (Typ): 5.3V (Max); Voltage - Breakdown (Min): 7V; Voltage - Clamping (Max) @ Ipp: 14V; Current - Peak Pulse (10/1000µs): 3A (8/20µs); Power Line Protection: No; Capacitance @ Frequency: 0.2pF @ 1MHz; Supplier 1: Digi-Key; RoHS: RoHS Compliant; Category: Circuit Protection; Stock 1: 2295; Pricing 1: 1=0.39, 10=0.315, 100=0.2142, 500=0.16068, 1000=0.12051 (USD); Packaging: Cut Tape (CT); Part Status: Active; Type: Zener; Power - Peak Pulse: -; Applications: Automotive, RF Antenna; Operating Temperature: -55°C ~ 150°C (TJ); Mounting Type: Surface Mount; Package / Case: 2-XFDFN; Supplier Device Package: 2-X3DFN (0.62x0.32); ComponentLink1URL: http://www.onsemi.com/pub/Collateral/ESD8472-D.PDF; ComponentLink1Description: http://www.onsemi.com/pub/Collateral/ESD8472-D.PDF; Supplier Part Number 1: ESD8472MUT5GOSCT-ND
IC1 = LMS7002Mr3: as IC1 on sheet 05_LMS7002M_Misc; Supplier 1: Lime Microsystems; Supplier Part Number 1: LMS7002M; Manufacturer Part Number 1: LMS7002M
IC4 = Duplexer_taiyo_yuden_8pin: Part Description: RF Diplexor 880MHz ~ 915MHz / 925MHz ~ 960MHz 8-SMD, No Lead; Manufacturer: Taiyo Yuden; Manufacturer Part Number 1: D5DA942M5K2S2; Supplier Part Number 1: D5DA942M5K2S2; Supplier 1: Taiyo Yuden
IC5 IC7 = SKY13411-374LF: Manufacturer: Skyworks Solutions Inc.; Part Description: RF Switch IC 802.11a/b/g/n DPDT 50 Ohm 6-MLPD (1.5x1.5); Frequency - Lower: 100MHz; Isolation @ Frequency: 14dB @ 6GHz (typ); Insertion Loss @ Frequency: 0.9dB @ 6GHz; IIP3: 50dBm (typ); Topology: Reflective; Circuit: DPDT; P1dB: 30dBm (typ) IP1dB; Impedance: 50 Ohm; RF Type: 802.11a/b/g/n; Supplier 1: Digi-Key; Manufacturer Part Number 1: SKY13411-374LF; RoHS: RoHS Compliant; Category: RF/IF and RFID; Stock 1: 18782; Pricing 1: 1=0.88, 10=0.782, 100=0.6099, 500=0.50382, 1000=0.39776 (USD); Packaging: Cut Tape (CT); Part Status: Active; Features: -; Operating Temperature: -40°C ~ 85°C; Voltage - Supply: -; Package / Case: 6-XFDFN Exposed Pad; Supplier Device Package: 6-MLPD (1.5x1.5); ComponentLink1URL: http://www.skyworksinc.com/uploads/documents/201665B.pdf; ComponentLink1Description: http://www.skyworksinc.com/uploads/documents/201665B.pdf; Supplier Part Number 1: 863-1455-1-ND
IC6 = Duplexer_taiyo_yuden_8pin: Part Description: SAW DUPLEXER, LTE, BAND 3, 1814; Manufacturer: Taiyo Yuden; Manufacturer Part Number 1: D6DA1G842K2C4-Z; Supplier Part Number 1: D6DA1G842K2C4-Z; Supplier 1: Taiyo Yuden
J1 J2 = RF_IF_connector: CONN SMA JACK STR 50OHM EDGE MNT; Manufacturer: RF Solutions; Manufacturer Part Number 1: CON-SMA-EDGE-S; Part Description: SMA Connector Jack, Female Socket Board Edge, End Launch Solder; Connector Type: Jack, Female Socket; Contact Termination: Solder; Supplier 1: Digi-Key; Supplier Part Number 1: CON-SMA-EDGE-S-ND; RoHS: RoHS Compliant; Category: Connectors, Interconnects; Stock 1: 1751; Pricing 1: 1=2.1 (USD); Packaging: -; Part Status: Active; Connector Style: SMA; Shield Termination: Solder; Impedance: -; Mounting Type: Board Edge, End Launch; Mounting Feature: -; Cable Group: -; Fastening Type: Threaded; Frequency - Max: -; Features: -; Housing Color: -; Ingress Protection: -; Includes: -; Body Material: -; Body Finish: -; Center Contact Plating: -; Dielectric Material: -; Operating Temperature: -; Center Contact Material: -; Voltage Rating: -; Mating Cycles: -; Insertion Loss: -; ComponentLink1URL: http://media.digikey.com/pdf/Data%20Sheets/RF%20Solutions%20PDFs/CON-SMA-EDGE.pdf; ComponentLink1Description: http://media.digikey.com/pdf/Data%20Sheets/RF%20Solutions%20PDFs/CON-SMA-EDGE.pdf
MN1 MN2 MN4 MN8 MN22 = Inductor_0603: Manufacturer: COILCRAFT; Manufacturer Part Number 1: 0402HP-8N2XJLU; Part Description: Surface Mount High Frequency Inductor, 0402HP Series, 8.2 nH, ± 5%, 0402 [1005 Metric], 5.4 GHz; Inductor Construction: Wirewound; DC Current Rating: 1.5; Inductor Case Style: 0402 [1005 Metric]<!--FANDB--><div class="features-and-benefits-container"></div>; Self Resonant Frequency Min: 5.4; DC Resistance Max: 0.065; High Frequency Inductor Case: 0402 [1005 Metric]; SVHC: No SVHC (16-Jun-2014); Inductance: 8.2; Supplier 1: Farnell; Supplier Part Number 1: 2285826; Packaging: Cut Tape; Product Range: COILCRAFT - 0402; Inductance Tolerance: ± 5%; RoHS: Y-EX; Value: 8.2nH, 5%
MN3 MN7 = Cap_0402: Manufacturer: Murata Electronics North America; Manufacturer Part Number: GRM1555C1HR80BA01D; Part Description: 0.80pF ±0.1pF 50V C0G, NP0 Ceramic Capacitor -55°C ~ 125°C Surface Mount, MLCC 0402 (1005 Metric) 0.039" L x 0.020" W (1.00mm x 0.50mm); Temperature Coefficient: C0G, NP0; Capacitance: 0.80pF; Voltage - Rated: 50V; Tolerance: ±0.1pF; Value: 0.8pF; Applications: General Purpose; Operating Temperature: -55°C ~ 125°C; Size / Dimension: 0.039" L x 0.020" W (1.00mm x 0.50mm); Features: -; Supplier 1: Digi-Key; Height - Seated (Max): -; Category: Capacitors; Package / Case: 0402 (1005 Metric); Mounting Type: Surface Mount, MLCC; Lead Spacing: -; Thickness (Max): 0.022" (0.55mm); RoHS: RoHS Compliant; Supplier Part Number 1: 490-6269-1-ND; Packaging: Cut Tape (CT); Ratings: -; Lead Style: -
MN5 MN15 MN27 = Cap_0402: Manufacturer: TDK Corporation; Manufacturer Part Number 1: C1005C0G1H010B050BA; Part Description: 1pF ±0.1pF 50V C0G, NP0 Ceramic Capacitor -55°C ~ 125°C Surface Mount, MLCC 0402 (1005 Metric) 0.039" L x 0.020" W (1.00mm x 0.50mm); Voltage - Rated: 50V; Temperature Coefficient: C0G, NP0; Tolerance: ±0.1pF; Value: 1pF; Supplier 1: Digi-Key; Supplier Part Number 1: 445-4854-6-ND; Size / Dimension: 0.039" L x 0.020" W (1.00mm x 0.50mm); Lead Spacing: -; Operating Temperature: -55°C ~ 125°C; Thickness (Max): 0.022" (0.55mm); Package / Case: 0402 (1005 Metric); Features: -; Lead Style: -; Applications: General Purpose; Height - Seated (Max): -; Capacitance: 1pF; RoHS: RoHS Compliant; Mounting Type: Surface Mount, MLCC; Packaging: Digi-Reel®; Ratings: -; Category: Capacitors
MN6 MN26 = Cap_0402: Manufacturer: Yageo; Manufacturer Part Number 1: CC0402CRNPO9BNR50; Part Description: 0.50pF ±0.25pF 50V C0G, NP0 Ceramic Capacitor -55°C ~ 125°C Surface Mount, MLCC 0402 (1005 Metric) 0.039" L x 0.020" W (1.00mm x 0.50mm); Capacitance: 0.50pF; Voltage - Rated: 50V; Temperature Coefficient: C0G, NP0; Tolerance: ±0.25pF; Value: 0.5pF; Supplier 1: Digi-Key; Supplier Part Number 1: 311-1001-1-ND; RoHS: RoHS Compliant; Thickness (Max): 0.022" (0.55mm); Features: -; Height - Seated (Max): -; Lead Spacing: -; Applications: General Purpose; Packaging: Cut Tape (CT); Ratings: -; Size / Dimension: 0.039" L x 0.020" W (1.00mm x 0.50mm); Lead Style: -; Mounting Type: Surface Mount, MLCC; Operating Temperature: -55°C ~ 125°C; Package / Case: 0402 (1005 Metric); Category: Capacitors
MN9 = Inductor_0603: Part Description: 22nH Unshielded Wirewound Inductor 310mA 300 mOhm Max 0402 (1005 Metric); Manufacturer: Murata Electronics North America; Manufacturer Part Number 1: LQW15AN22NJ00D; Material - Core: Non-Magnetic; Shielding: Unshielded; DC Resistance (DCR): 300 mOhm Max; Q @ Freq: 25 @ 250MHz; Frequency - Self Resonant: 4GHz; Value: 22nH, 5%; Supplier 1: Digi-Key; Supplier Part Number 1: 490-1150-1-ND; RoHS: RoHS Compliant; Category: Inductors, Coils, Chokes; Stock 1: 120331; Pricing 1: 1=0.17, 10=0.155, 100=0.1035, 500=0.08626, 1000=0.07245, 2500=0.0621 (USD); Packaging: Cut Tape (CT); Part Status: Active; Type: Wirewound; Tolerance: ±5%; Current - Saturation: -; Ratings: -; Operating Temperature: -55°C ~ 125°C; Mounting Type: Surface Mount; Package / Case: 0402 (1005 Metric); Supplier Device Package: 0402 (1005 Metric); Size / Dimension: 0.039" L x 0.020" W (1.00mm x 0.50mm); Height - Seated (Max): 0.024" (0.60mm); ComponentLink1URL: http://search.murata.co.jp/Ceramy/image/img/P02/JELF243A-0050.pdf; ComponentLink1Description: http://search.murata.co.jp/Ceramy/image/img/P02/JELF243A-0050.pdf
MN10 MN11 = Inductor_0603: Manufacturer: TDK Corporation; Manufacturer Part Number: MLF2012C101KT000; Part Description: FIXED IND 100UH 2MA 3.1 OHM SMD; Q @ Freq: 25 @ 1MHz; Shielding: Shielded; Current Rating: 2mA; Frequency - Self Resonant: 7MHz; Frequency - Test: 1MHz; Material - Core: Ferrite; Tolerance: ±10%; Inductance: 100µH; DC Resistance (DCR): 3.1 Ohm Max; Value: 100uH; Supplier 1: Digi-Key; Supplier Part Number 1: 445-1071-1-ND; Supplier Device Package: 0805 (2012 Metric); Size / Dimension: 0.079" L x 0.049" W (2.00mm x 1.25mm); Operating Temperature: -40°C ~ 85°C; Packaging: Cut Tape (CT); RoHS: RoHS Compliant; Current - Saturation: -; Height - Seated (Max): 0.057" (1.45mm); Package / Case: 0805 (2012 Metric); Mounting Type: Surface Mount; Type: Multilayer; Category: Inductors, Coils, Chokes
MN12 MN13 = Res_0402: Manufacturer: Yageo; Part Description: RES SMD 0.0OHM JUMPER 1/16W 0402; Manufacturer Part Number 1: RC0402JR-070RL; Supplier 1: Digi-Key; Supplier Part Number 1: 311-0.0JRTR-ND; Composition: Thick Film; Package / Case: 0402 (1005 Metric); Category: Resistors; Value: 0R
MN14 MN17 = Cap_0402: Manufacturer: Murata Electronics; Manufacturer Part Number: GRM155R71C104KA88D; Part Description: CAP CER 0.1UF 16V X7R 0402; Tolerance: 10 %; Capacitance: 0.1 uF; Case Length: 1 mm; Dielectric: X7R; Case Height: 0.5 mm; Temperature Coefficient / Code: +/- 15 %; Value: 100nF, 16V; Supplier 1: Mouser; Supplier Part Number 1: 81-GRM155R71C104KA88; Case Code - in: 0402; RoHS: RoHS Compliant; Operating Temperature Range: - 55 C to + 125 C; Series: GRM; Termination Style: SMD/SMT; Package / Case: 0402 (1005 metric); Voltage Rating DC: 16 V; Type: General Purpose MLCC; Maximum Operating Temperature: + 125 C; Case Code - mm: 1005; Minimum Operating Temperature: - 55 C; Product Category: Low & Medium Capacitance SMD Ceramic Chip Capacitors; Packaging: Reel; Product: General Type MLCCs; Category: Multilayer Ceramic Capacitors MLCC - SMD/SMT; Brand: Murata Electronics; Case Width: 0.5 mm; RoHS - Mouser: Y; Standard Pack Qty: 10000; Minimum Order Quantity: 1; Reeling: True; Manufacturer Part Number 1: GRM155R71C104KA88D
MN16 MN25 MN28 = Cap_0402: Manufacturer: AVX; Part Description: SMD Multilayer Ceramic Capacitor, U Series, 2 pF, ± 0.1pF, C0G / NP0, 50 V, 0402 [1005 Metric]; Manufacturer Part Number 1: 04025U2R0BAT2A; Product Range: U Series; Voltage Rating: 50; SVHC: No SVHC (17-Dec-2014); Capacitance Tolerance: ± 0.1; Ceramic Capacitor Case: 0402 [1005 Metric]; Capacitance: 2; Dielectric Characteristic: C0G / NP0; Value: 2pF; Supplier 1: Farnell; Supplier Part Number 1: 2332536; Operating Temperature Max: 125; RoHS: YES; Operating Temperature Min: -55; Capacitance Tolerance ±: ± 0.1; Packaging: Cut Tape; MSL: MSL 1 - Unlimited
MN18 = Inductor_0603: Part Description: 4.3nH Unshielded Multilayer Inductor 700mA 200 mOhm Max 0402 (1005 Metric); Manufacturer: TDK Corporation; Manufacturer Part Number 1: MLG1005S4N3STD25; Material - Core: Non-Magnetic; Tolerance: ±0.3nH; Shielding: Unshielded; DC Resistance (DCR): 200 mOhm Max; Q @ Freq: 8 @ 100MHz; Frequency - Self Resonant: 4.5GHz; Value: 4.3nH, 5%; Supplier 1: Digi-Key; Supplier Part Number 1: 445-16307-1-ND; RoHS: RoHS Compliant; Category: Inductors, Coils, Chokes; Stock 1: 19895; Pricing 1: 1=0.1, 10=0.078, 100=0.0518, 500=0.04312, 1000=0.03623, 2500=0.03105 (USD); Packaging: Cut Tape (CT); Part Status: Active; Type: Multilayer; Current - Saturation: -; Ratings: AEC-Q200; Operating Temperature: -55°C ~ 125°C; Mounting Type: Surface Mount; Package / Case: 0402 (1005 Metric); Supplier Device Package: 0402 (1005 Metric); Size / Dimension: 0.039" L x 0.020" W (1.00mm x 0.50mm); Height - Seated (Max): 0.022" (0.55mm); ComponentLink1URL: https://product.tdk.com/info/en/catalog/datasheets/inductor_automotive_high-frequency_mlg1005s_en.pdf; ComponentLink1Description: https://product.tdk.com/info/en/catalog/datasheets/inductor_automotive_high-frequency_mlg1005s_en.pdf
MN19 MN24 = Cap_0402: Manufacturer: Murata Electronics North America; Manufacturer Part Number: GRM1555C1H511JA01D; Part Description: 510pF ±5% 50V C0G, NP0 Ceramic Capacitor -55°C ~ 125°C Surface Mount, MLCC 0402 (1005 Metric) 0.039" L x 0.020" W (1.00mm x 0.50mm); Voltage - Rated: 50V; Temperature Coefficient: C0G, NP0; Tolerance: ±5%; Value: 510pF; Supplier 1: Digi-Key; Supplier Part Number 1: 490-3237-1-ND; Height - Seated (Max): -; Features: -; Size / Dimension: 0.039" L x 0.020" W (1.00mm x 0.50mm); Applications: General Purpose; Lead Spacing: -; Package / Case: 0402 (1005 Metric); Ratings: -; Thickness (Max): 0.022" (0.55mm); Lead Style: -; Operating Temperature: -55°C ~ 125°C; Mounting Type: Surface Mount, MLCC; Capacitance: 510pF; Category: Capacitors; RoHS: RoHS Compliant; Packaging: Cut Tape (CT)
MN20 = Inductor_0603: Part Description: 12nH Unshielded Multilayer Inductor 500mA 280 mOhm Max 0402 (1005 Metric); Manufacturer: Murata Electronics North America; Manufacturer Part Number 1: LQG15HS12NJ02D; Material - Core: Air; Shielding: Unshielded; DC Resistance (DCR): 280 mOhm Max; Q @ Freq: 8 @ 100MHz; Frequency - Self Resonant: 3GHz; Value: 12nH, 5%; Supplier 1: Digi-Key; Supplier Part Number 1: 490-2624-1-ND; RoHS: RoHS Compliant; Category: Inductors, Coils, Chokes; Stock 1: 107843; Pricing 1: 1=0.1, 10=0.061, 100=0.0404, 500=0.03366, 1000=0.02827, 2500=0.02423 (USD); Packaging: Cut Tape (CT); Part Status: Active; Type: Multilayer; Tolerance: ±5%; Current - Saturation: -; Ratings: -; Operating Temperature: -55°C ~ 125°C; Mounting Type: Surface Mount; Package / Case: 0402 (1005 Metric); Supplier Device Package: 0402 (1005 Metric); Size / Dimension: 0.039" L x 0.020" W (1.00mm x 0.50mm); Height - Seated (Max): 0.022" (0.55mm); ComponentLink1URL: http://search.murata.co.jp/Ceramy/image/img/P02/JELF243B-0010.pdf; ComponentLink1Description: http://search.murata.co.jp/Ceramy/image/img/P02/JELF243B-0010.pdf
MN21 = Inductor_0603: Part Description: 10nH Unshielded Multilayer Inductor 500mA 260 mOhm Max 0402 (1005 Metric); Manufacturer: Murata Electronics North America; Manufacturer Part Number 1: LQG15HS10NJ02D; Material - Core: Air; Shielding: Unshielded; DC Resistance (DCR): 260 mOhm Max; Q @ Freq: 8 @ 100MHz; Frequency - Self Resonant: 3.4GHz; Value: 10nH, 5%; Supplier 1: Digi-Key; Supplier Part Number 1: 490-2623-1-ND; RoHS: RoHS Compliant; Category: Inductors, Coils, Chokes; Stock 1: 216002; Pricing 1: 1=0.1, 10=0.061, 100=0.0404, 500=0.03366, 1000=0.02827, 2500=0.02423 (USD); Packaging: Cut Tape (CT); Part Status: Active; Type: Multilayer; Tolerance: ±5%; Current - Saturation: -; Ratings: -; Operating Temperature: -55°C ~ 125°C; Mounting Type: Surface Mount; Package / Case: 0402 (1005 Metric); Supplier Device Package: 0402 (1005 Metric); Size / Dimension: 0.039" L x 0.020" W (1.00mm x 0.50mm); Height - Seated (Max): 0.022" (0.55mm); ComponentLink1URL: http://search.murata.co.jp/Ceramy/image/img/P02/JELF243B-0010.pdf; ComponentLink1Description: http://search.murata.co.jp/Ceramy/image/img/P02/JELF243B-0010.pdf
MN23 = Cap_0402: Manufacturer: Murata Electronics North America; Manufacturer Part Number 1: GRM1555C1H1R2CA01D; Part Description: '1.2pF ±0.25pF 50V C0G, NP0 Ceramic Capacitor -55°C ~ 125°C Surface Mount, MLCC 0402 (1005 Metric) 0.039" L x 0.020" W (1.00mm x 0.50mm); Temperature Coefficient: C0G, NP0; Voltage - Rated: 50V; Tolerance: ±0.25pF; Value: 1.2pF; Supplier 1: Digi-Key; Supplier Part Number 1: 490-5927-1-ND; Lead Style: -; Category: Capacitors; Features: -; Packaging: Cut Tape (CT); Operating Temperature: -55°C ~ 125°C; Package / Case: 0402 (1005 Metric); Applications: General Purpose; Size / Dimension: 0.039" L x 0.020" W (1.00mm x 0.50mm); Lead Spacing: -; Ratings: -; Mounting Type: Surface Mount, MLCC; RoHS: RoHS Compliant; Height - Seated (Max): -; Thickness (Max): 0.022" (0.55mm); Capacitance: 1.2pF
R14-R23 = Res_0402: Manufacturer Part Number 1: RC0402JR-070RL; Manufacturer: Yageo; Part Description: RES SMD 0.0OHM JUMPER 1/16W 0402; Resistance (Ohms): 0.0; Tolerance: Jumper; Power (Watts): 0.063W, 1/16W; Value: 0R; Supplier 1: Digi-Key; Supplier Part Number 1: 311-0.0JRTR-ND; Category: Resistors; Temperature Coefficient: -; Features: Moisture Resistant; Supplier Device Package: 0402; Height: 0.016" (0.40mm); Package / Case: 0402 (1005 Metric); Operating Temperature: -55°C ~ 155°C; Size / Dimension: 0.039" L x 0.020" W (1.00mm x 0.50mm); Composition: Thick Film; Packaging: Tape & Reel (TR); Number of Terminations: 2; RoHS: RoHS Compliant
T1-T4 = TC1-1-13M+: Part Description: RF balun; 1:1 ratio; 3 dB bandwidth: 0.3 MHz to 3.5 GHz; 3.8mm x 3.8mm; Manufacturer: Minicircuits; Supplier 1: Minicircuits; Manufacturer Part Number 1: TC1-1-13M-45+; Supplier Part Number 1: TC1-1-13M-45+